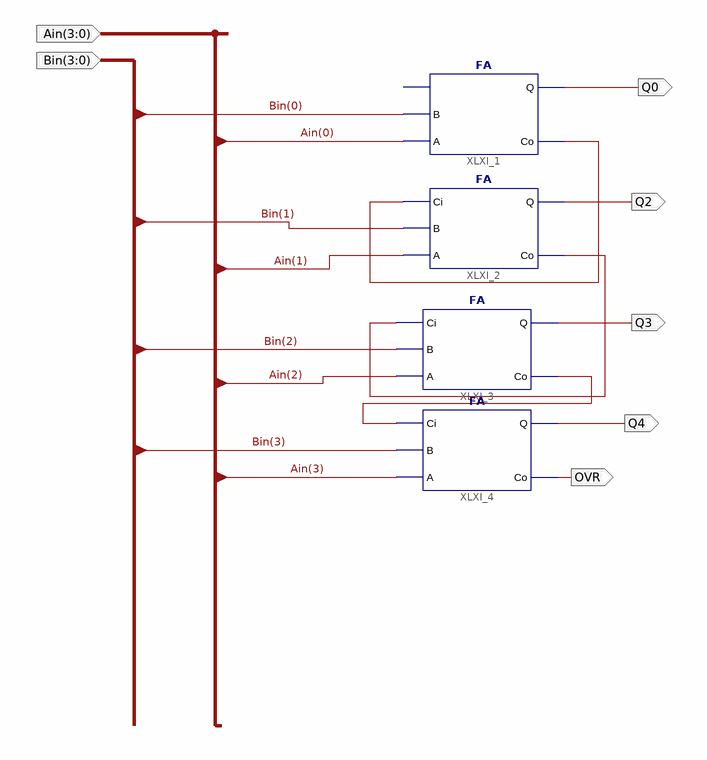
[diagram p0: schematic sheet 1]
// Xilinx ISE schematic PFA.sch (spartan6) as structural Verilog: 4 symbols, 7 ports
module PFA (
  input  [3:0] Bin,
  input  [3:0] Ain,
  output Q0,
  output Q2,
  output Q3,
  output Q4,
  output OVR
);

  wire XLXN_34, XLXN_70, XLXN_71;

  FA XLXI_1 (.B(Bin[0]), .A(Ain[0]), .Q(Q0), .Co(XLXN_71));  // open: Ci
  FA XLXI_2 (.Ci(XLXN_71), .B(Bin[1]), .A(Ain[1]), .Q(Q2), .Co(XLXN_34));
  FA XLXI_3 (.Ci(XLXN_34), .B(Bin[2]), .A(Ain[2]), .Q(Q3), .Co(XLXN_70));
  FA XLXI_4 (.Ci(XLXN_70), .B(Bin[3]), .A(Ain[3]), .Q(Q4), .Co(OVR));
endmodule
